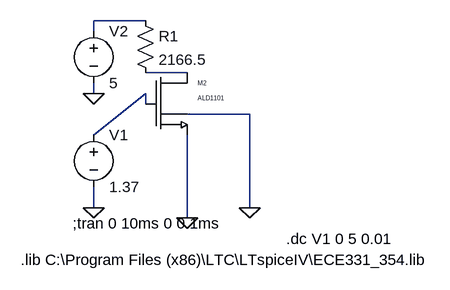
[diagram p0: schematic Draft1-dc.asc]
Draft1-dc.asc, the LTspice schematic file:
Version 4
SHEET 1 880 680
WIRE 16 0 -64 0
WIRE -64 16 -64 0
WIRE 80 80 16 80
WIRE -64 112 -64 96
WIRE 16 128 16 112
WIRE 176 144 80 144
WIRE -64 176 16 112
WIRE -64 288 -64 256
WIRE 176 288 176 144
WIRE 80 304 80 176
FLAG 80 304 0
FLAG -64 288 0
FLAG -64 112 0
FLAG 176 288 0
SYMBOL voltage -64 160 R0
WINDOW 123 0 0 Left 2
WINDOW 39 0 0 Left 2
SYMATTR InstName V1
SYMATTR Value 1.37
SYMBOL voltage -64 0 R0
WINDOW 123 0 0 Left 2
WINDOW 39 0 0 Left 2
SYMATTR InstName V2
SYMATTR Value 5
SYMBOL res 0 -16 R0
SYMATTR InstName R1
SYMATTR Value 2166.5
SYMBOL ALD1101 16 80 R0
SYMATTR InstName M2
TEXT -96 312 Left 2 !;tran 0 10ms 0 0.1ms
TEXT -176 368 Left 2 !.lib C:\\Program Files (x86)\\LTC\\LTspiceIV\\ECE331_354.lib
TEXT 232 336 Left 2 !.dc V1 0 5 0.01

The netlist it stands for:
* Draft1-dc.asc
V1 N003 0 1.37
V2 N001 0 5
R1 N001 N002 2166.5
M2 N002 N003 0 0 ALD1101 W=1.379e-3 L=1E-6
.model NMOS NMOS
.model PMOS PMOS
.lib standard.mos
;tran 0 10ms 0 0.1ms
.lib C:\Program Files (x86)\LTC\LTspiceIV\ECE331_354.lib
.dc V1 0 5 0.01
.backanno
.end